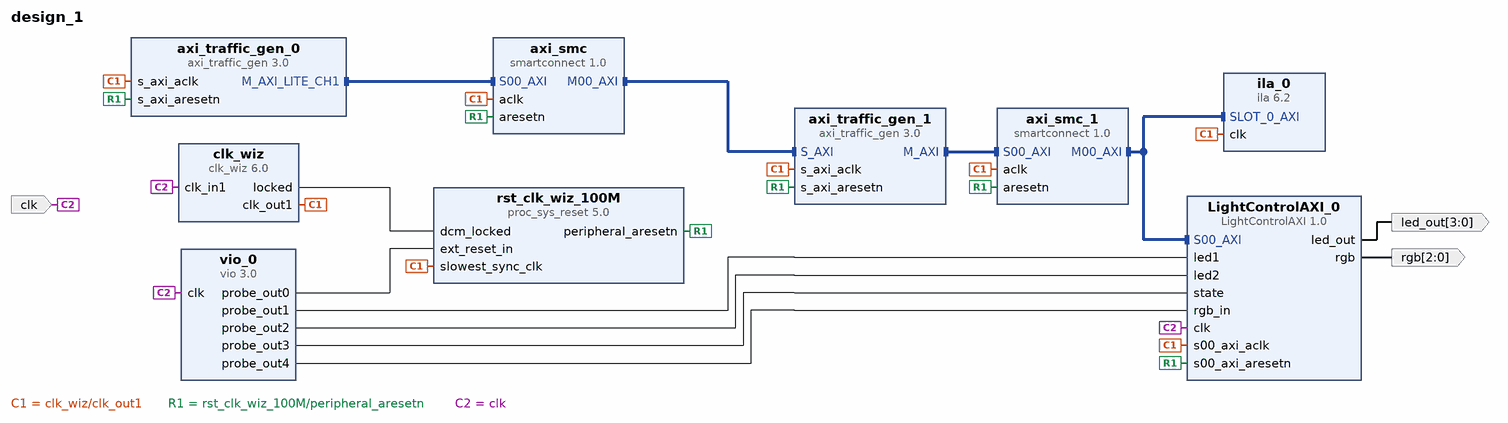
[diagram p0: block diagram of the top level]
# Vivado block design design_1, xc7z010clg400-1, Vivado 2020.1
create_bd_design design_1

create_bd_port -dir I -type clk clk
create_bd_port -dir O -from 3 -to 0 led_out
create_bd_port -dir O -from 2 -to 0 rgb

create_bd_cell -type ip -vlnv xilinx.com:user:LightControlAXI:1.0 LightControlAXI_0
create_bd_cell -type ip -vlnv xilinx.com:ip:axi_traffic_gen:3.0 axi_traffic_gen_0
set_property -dict [list \
  CONFIG.C_ATG_MODE AXI4-Lite \
  CONFIG.C_ATG_SYSINIT_MODES System_Test \
  CONFIG.C_ATG_SYSTEM_CMD_MAX_RETRY 2147483647 \
  CONFIG.C_ATG_SYSTEM_INIT_ADDR_MIF ../../../../../../../LightControllerCoes/addrLC.coe \
  CONFIG.C_ATG_SYSTEM_INIT_CTRL_MIF ../../../../../../../LightControllerCoes/ctrlLC.coe \
  CONFIG.C_ATG_SYSTEM_INIT_DATA_MIF ../../../../../../../LightControllerCoes/dataLC.coe \
  CONFIG.C_ATG_SYSTEM_INIT_MASK_MIF ../../../../../../../LightControllerCoes/maskLC.coe \
] [get_bd_cells axi_traffic_gen_0]
create_bd_cell -type ip -vlnv xilinx.com:ip:axi_traffic_gen:3.0 axi_traffic_gen_1
create_bd_cell -type ip -vlnv xilinx.com:ip:smartconnect:1.0 axi_smc
set_property -dict {CONFIG.NUM_SI 1} [get_bd_cells axi_smc]
create_bd_cell -type ip -vlnv xilinx.com:ip:clk_wiz:6.0 clk_wiz
set_property -dict {CONFIG.USE_RESET false} [get_bd_cells clk_wiz]
create_bd_cell -type ip -vlnv xilinx.com:ip:proc_sys_reset:5.0 rst_clk_wiz_100M
create_bd_cell -type ip -vlnv xilinx.com:ip:smartconnect:1.0 axi_smc_1
set_property -dict {CONFIG.NUM_SI 1} [get_bd_cells axi_smc_1]
create_bd_cell -type ip -vlnv xilinx.com:ip:vio:3.0 vio_0
set_property -dict [list \
  CONFIG.C_NUM_PROBE_IN 0 \
  CONFIG.C_NUM_PROBE_OUT 5 \
  CONFIG.C_PROBE_OUT1_WIDTH 4 \
  CONFIG.C_PROBE_OUT2_WIDTH 4 \
  CONFIG.C_PROBE_OUT3_WIDTH 3 \
  CONFIG.C_PROBE_OUT4_WIDTH 3 \
] [get_bd_cells vio_0]
create_bd_cell -type ip -vlnv xilinx.com:ip:ila:6.2 ila_0

# ---- connections ----

connect_bd_intf_net [get_bd_intf_pins axi_smc_1/M00_AXI] [get_bd_intf_pins LightControlAXI_0/S00_AXI]
connect_bd_intf_net [get_bd_intf_pins axi_smc_1/M00_AXI] [get_bd_intf_pins ila_0/SLOT_0_AXI]
connect_bd_intf_net [get_bd_intf_pins axi_traffic_gen_0/M_AXI_LITE_CH1] [get_bd_intf_pins axi_smc/S00_AXI]
connect_bd_intf_net [get_bd_intf_pins axi_smc/M00_AXI] [get_bd_intf_pins axi_traffic_gen_1/S_AXI]
connect_bd_intf_net [get_bd_intf_pins axi_traffic_gen_1/M_AXI] [get_bd_intf_pins axi_smc_1/S00_AXI]
connect_bd_net [get_bd_pins clk_wiz/clk_out1] \
  [get_bd_pins axi_traffic_gen_0/s_axi_aclk] [get_bd_pins axi_smc/aclk] [get_bd_pins rst_clk_wiz_100M/slowest_sync_clk] \
  [get_bd_pins axi_traffic_gen_1/s_axi_aclk] [get_bd_pins axi_smc_1/aclk] [get_bd_pins LightControlAXI_0/s00_axi_aclk] \
  [get_bd_pins ila_0/clk]
connect_bd_net [get_bd_pins clk_wiz/locked] [get_bd_pins rst_clk_wiz_100M/dcm_locked]
connect_bd_net [get_bd_pins rst_clk_wiz_100M/peripheral_aresetn] \
  [get_bd_pins axi_traffic_gen_0/s_axi_aresetn] [get_bd_pins axi_traffic_gen_1/s_axi_aresetn] [get_bd_pins axi_smc/aresetn] \
  [get_bd_pins LightControlAXI_0/s00_axi_aresetn] [get_bd_pins axi_smc_1/aresetn]
connect_bd_net -net clk_0_1 [get_bd_ports clk] [get_bd_pins LightControlAXI_0/clk] [get_bd_pins clk_wiz/clk_in1] [get_bd_pins vio_0/clk]
connect_bd_net [get_bd_pins LightControlAXI_0/led_out] [get_bd_ports led_out]
connect_bd_net [get_bd_pins LightControlAXI_0/rgb] [get_bd_ports rgb]
connect_bd_net [get_bd_pins vio_0/probe_out0] [get_bd_pins rst_clk_wiz_100M/ext_reset_in]
connect_bd_net [get_bd_pins vio_0/probe_out1] [get_bd_pins LightControlAXI_0/led1]
connect_bd_net [get_bd_pins vio_0/probe_out2] [get_bd_pins LightControlAXI_0/led2]
connect_bd_net [get_bd_pins vio_0/probe_out3] [get_bd_pins LightControlAXI_0/state]
connect_bd_net [get_bd_pins vio_0/probe_out4] [get_bd_pins LightControlAXI_0/rgb_in]

# ---- address map ----
assign_bd_address -offset 0x44A00000 -range 64K -target_address_space [get_bd_addr_spaces axi_traffic_gen_0/Reg1] [get_bd_addr_segs axi_traffic_gen_1/S_AXI/Reg0]
assign_bd_address -offset 0x76000000 -range 64K -target_address_space [get_bd_addr_spaces axi_traffic_gen_1/Data] [get_bd_addr_segs LightControlAXI_0/S00_AXI/S00_AXI_mem]

validate_bd_design
save_bd_design
